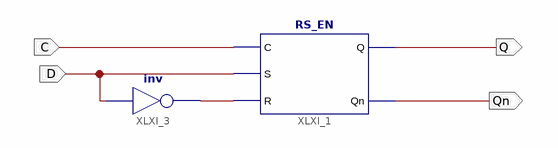
[diagram p0: schematic sheet 1]
// Xilinx ISE schematic D_EN.sch (spartan3) as structural Verilog: 2 symbols, 4 ports
module D_EN (
  input  D,
  input  C,
  output Q,
  output Qn
);

  wire XLXN_5;

  RS_EN XLXI_1 (.C(C), .S(D), .R(XLXN_5), .Q(Q), .Qn(Qn));
  not XLXI_3 (XLXN_5, D);
endmodule
